# EAGLE design csa_scsi_v1.2b (EAGLE 4.16)
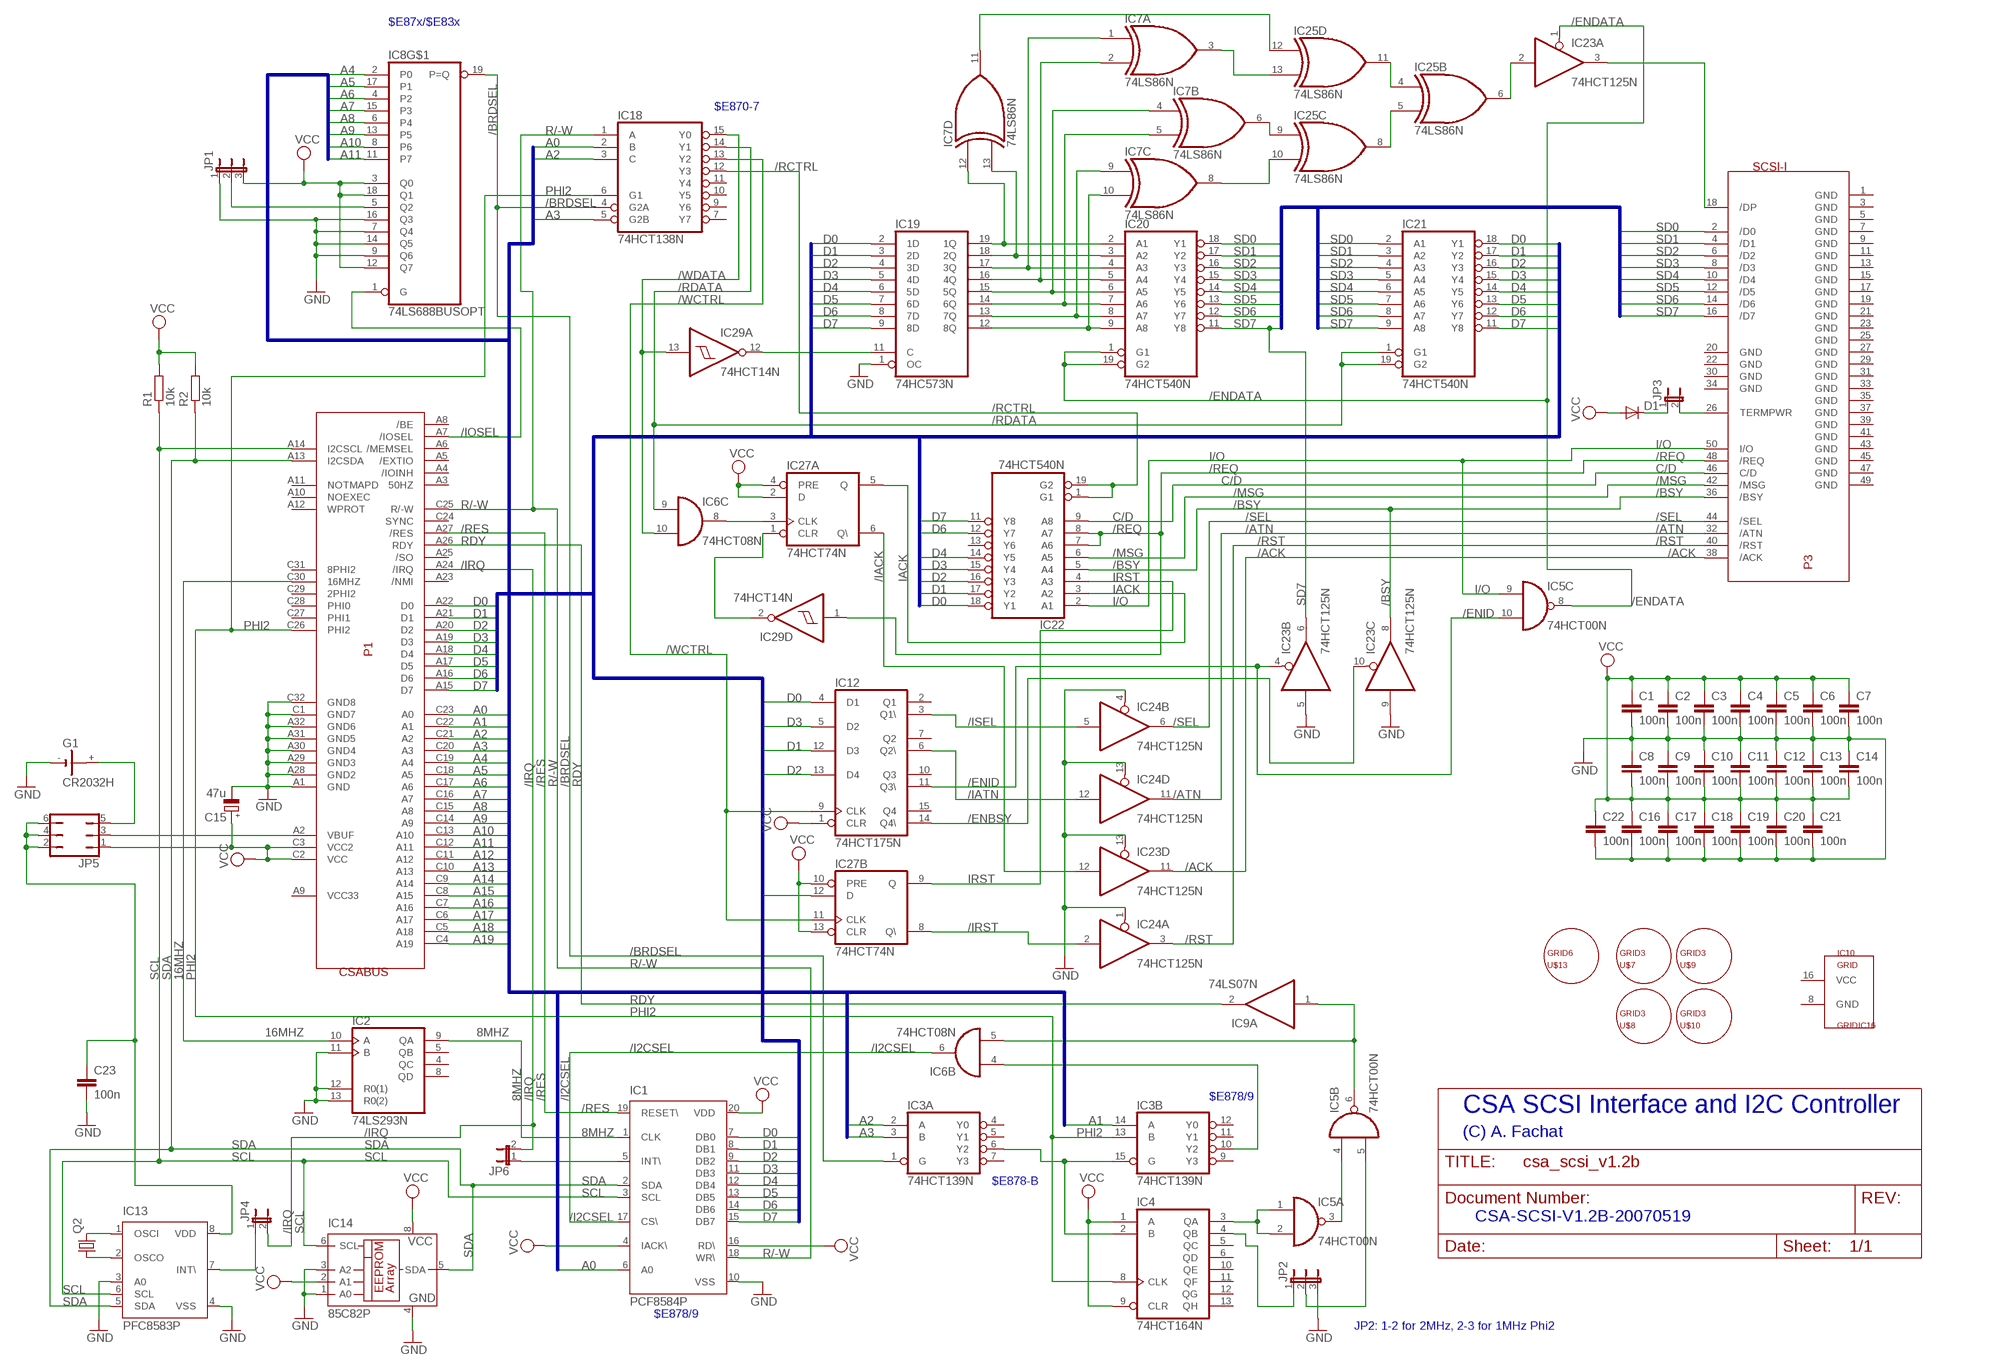
[diagram p0: schematic, sheet 1]

## Parts
C1  100n  C-EU025-025X050  [C025-025X050]
C2  100n  C-EU025-025X050  [C025-025X050]
C3  100n  C-EU025-025X050  [C025-025X050]
C4  100n  C-EU025-025X050  [C025-025X050]
C5  100n  C-EU025-025X050  [C025-025X050]
C6  100n  C-EU025-025X050  [C025-025X050]
C7  100n  C-EU025-025X050  [C025-025X050]
C8  100n  C-EU025-025X050  [C025-025X050]
C9  100n  C-EU025-025X050  [C025-025X050]
C10  100n  C-EU025-025X050  [C025-025X050]
C11  100n  C-EU025-025X050  [C025-025X050]
C12  100n  C-EU025-025X050  [C025-025X050]
C13  100n  C-EU025-025X050  [C025-025X050]
C14  100n  C-EU025-025X050  [C025-025X050]
C15  47u  CPOL-EUE2.5-5  [E2,5-5]
C16  100n  C-EU025-025X050  [C025-025X050]
C17  100n  C-EU025-025X050  [C025-025X050]
C18  100n  C-EU025-025X050  [C025-025X050]
C19  100n  C-EU025-025X050  [C025-025X050]
C20  100n  C-EU025-025X050  [C025-025X050]
C21  100n  C-EU025-025X050  [C025-025X050]
C22  100n  C-EU025-025X050  [C025-025X050]
C23  100n  C-EU025-025X050  [C025-025X050]
D1  DIODE-D-12.5  [D-12.5]
G1  CR2032H  [CR2032H]
IC1  PCF8584P  [DIL20]
IC2  74LS293N  [DIL14]
IC3  74HCT139N  [DIL16]
IC4  74HCT164N  [DIL14]
IC5  74HCT00N  [DIL14]
IC6  74HCT08N  [DIL14]
IC7  74LS86N  [DIL14]
IC8  74LS688BUSOPT  [DIL20]
IC9  74LS07N  [DIL14]
IC10  GRIDIC16  [GRIDIC8]
IC12  74HCT175N  [DIL16]
IC13  PFC8583P  [DIL08]
IC14  85C82P  [DIL8]
IC18  74HCT138N  [DIL16]
IC19  74HC573N  [DIL20]
IC20  74HCT540N  [DIL20]
IC21  74HCT540N  [DIL20]
IC22  74HCT540N  [DIL20]
IC23  74HCT125N  [DIL14]
IC24  74HCT125N  [DIL14]
IC25  74LS86N  [DIL14]
IC27  74HCT74N  [DIL14]
IC29  74HCT14N  [DIL14]
JP1  JP2E  [JP2]
JP2  JP2E  [JP2]
JP3  JP1E  [JP1]
JP4  JP1E  [JP1]
JP5  JP3Q  [JP3Q]
JP6  JP1E  [JP1]
P1  CSABUS  [CSABUS]
P3  SCSI-I  [FLAT50]
Q2  CRYTALHC49S  [HC49/S]
R1  10k  R-EU_0207/7  [0207/7]
R2  10k  R-EU_0207/7  [0207/7]
U$7  GRID3  [GRID3]
U$8  GRID3  [GRID3]
U$9  GRID3  [GRID3]
U$10  GRID3  [GRID3]
U$13  GRID6  [GRID6]

## Nets
8MHZ: IC1.1(CLK) IC2.9(QA)
16MHZ: IC2.10(A) P1.C30(16MHZ)
/ACK: IC23.11(D:O) P3.38(/ACK)
/ATN: IC24.11(D:O) P3.32(/ATN)
/BRDSEL: IC3.1(A:G) IC8.19(P=Q) IC18.4(G2A)
/BSY: IC22.5(A4) IC23.8(C:O) P3.36(/BSY)
/ENBSY: IC12.14(Q4\) IC23.10(C:OE)
/ENDATA: IC5.8(C:O) IC20.1(G1) IC20.19(G2) IC23.1(A:OE)
/ENID: IC5.10(C:I1) IC12.11(Q3\) IC23.4(B:OE)
/I2CSEL: IC1.17(CS\) IC6.6(B:O)
/IACK: IC23.12(D:I) IC27.6(A:Q\)
/IATN: IC12.6(Q2\) IC24.12(D:I)
/IOSEL: IC8.1(G) P1.A7(/IOSEL)
/IRQ: JP4.2 JP6.2 P1.A24(/IRQ)
/IRST: IC24.2(A:I) IC27.8(B:Q\)
/ISEL: IC12.3(Q1\) IC24.5(B:I)
/MSG: IC22.6(A5) P3.42(/MSG)
/RCTRL: IC18.12(Y3) IC22.1(G1) IC22.19(G2)
/RDATA: IC6.9(C:I0) IC18.14(Y1) IC21.1(G1) IC21.19(G2)
/REQ: IC22.7(A6) IC22.8(A7) IC29.1(D:I) P3.48(/REQ)
/RES: IC1.19(RESET\) P1.A27(/RES)
/RST: IC24.3(A:O) P3.40(/RST)
/SEL: IC24.6(B:O) P3.44(/SEL)
/WCTRL: IC12.9(CLK) IC18.13(Y2) IC27.11(B:CLK)
/WDATA: IC6.10(C:I1) IC18.15(Y0) IC29.13(A:I)
A0: IC1.6(A0) IC18.2(B) P1.C23(A0)
A1: IC3.14(B:A) P1.C22(A1)
A2: IC3.2(A:A) IC18.3(C) P1.C21(A2)
A3: IC3.3(A:B) IC18.5(G2B) P1.C20(A3)
A4: IC8.2(P0) P1.C19(A4)
A5: IC8.17(P1) P1.C18(A5)
A6: IC8.4(P2) P1.C17(A6)
A7: IC8.15(P3) P1.C16(A7)
A8: IC8.6(P4) P1.C15(A8)
A9: IC8.13(P5) P1.C14(A9)
A10: IC8.8(P6) P1.C13(A10)
A11: IC8.11(P7) P1.C12(A11)
A12: P1.C11(A12)
A13: P1.C10(A13)
A14: P1.C9(A14)
A15: P1.C8(A15)
A16: P1.C7(A16)
A17: P1.C6(A17)
A18: P1.C5(A18)
A19: P1.C4(A19)
C/D: IC22.9(A8) P3.46(C/D)
D0: IC1.7(DB0) IC12.4(D1) IC19.2(1D) IC21.18(Y1) IC22.18(Y1) P1.A22(D0)
D1: IC1.8(DB1) IC12.12(D3) IC19.3(2D) IC21.17(Y2) IC22.17(Y2) P1.A21(D1)
D2: IC1.9(DB2) IC12.13(D4) IC19.4(3D) IC21.16(Y3) IC22.16(Y3) P1.A20(D2)
D3: IC1.11(DB3) IC12.5(D2) IC19.5(4D) IC21.15(Y4) IC22.15(Y4) P1.A19(D3)
D4: IC1.12(DB4) IC19.6(5D) IC21.14(Y5) IC22.14(Y5) P1.A18(D4)
D5: IC1.13(DB5) IC19.7(6D) IC21.13(Y6) P1.A17(D5)
D6: IC1.14(DB6) IC19.8(7D) IC21.12(Y7) IC22.12(Y7) P1.A16(D6)
D7: IC1.15(DB7) IC19.9(8D) IC21.11(Y8) IC22.11(Y8) IC27.12(B:D) P1.A15(D7)
GND: C1.2 C2.2 C3.2 C4.2 C5.2 C6.2 C7.2 C8.1 C9.1 C10.1 C11.1 C12.1 C13.1 C14.1 C15.- C16.2 C17.2 C18.2 C19.2 C20.2 C21.2 C22.2 C23.2 G1.- IC1.10(VSS) IC2.11(B) IC2.12(R0(1)) IC2.13(R0(2)) IC8.7(Q4) IC8.9(Q6) IC8.14(Q5) IC8.16(Q3) IC13.3(A0) IC13.4(VSS) IC14.1(A0) IC14.3(A2) IC14.4(GND) IC19.1(OC) IC23.5(B:I) IC23.9(C:I) IC23.13(D:OE) IC24.1(A:OE) IC24.4(B:OE) IC24.13(D:OE) JP1.1 JP2.3 P1.A1(GND) P1.A28(GND2) P1.A29(GND3) P1.A30(GND4) P1.A31(GND5) P1.A32(GND6) P1.C1(GND7) P1.C32(GND8)
I/O: IC5.9(C:I0) IC22.2(A1) P3.50(I/O)
IACK: IC22.3(A2) IC27.5(A:Q)
IRST: IC22.4(A3) IC27.9(B:Q)
N$1: IC3.6(A:Y2) IC3.15(B:G) IC4.2(B)
N$2: D1.C JP3.1
N$3: IC8.5(Q2) JP1.2
N$4: IC3.10(B:Y2) IC6.4(B:I0)
N$5: IC4.3(QA) IC5.1(A:I0) IC5.2(A:I1)
N$6: JP3.2 P3.26(TERMPWR)
N$7: IC4.4(QB) JP2.1
N$8: IC5.5(B:I1) JP2.2
N$9: IC5.3(A:O) IC5.4(B:I0)
N$10: IC5.6(B:O) IC6.5(B:I1) IC9.1(A:I)
N$11: IC13.7(INT\) JP4.1
N$12: JP5.3 P1.A2(VBUF)
N$13: G1.+ JP5.5
N$14: IC7.12(D:I0) IC19.19(1Q) IC20.2(A1)
N$15: IC13.2(OSCO) Q2.1
N$16: IC13.1(OSCI) Q2.2
N$17: C23.1 IC13.8(VDD) JP5.2 JP5.4 JP5.6
N$18: IC7.13(D:I1) IC19.18(2Q) IC20.3(A2)
N$21: IC7.1(A:I0) IC19.17(3Q) IC20.4(A3)
N$22: IC7.2(A:I1) IC19.16(4Q) IC20.5(A4)
N$23: IC7.4(B:I0) IC19.15(5Q) IC20.6(A5)
N$24: IC7.5(B:I1) IC19.14(6Q) IC20.7(A6)
N$25: IC7.9(C:I0) IC19.13(7Q) IC20.8(A7)
N$26: IC7.10(C:I1) IC19.12(8Q) IC20.9(A8)
N$34: IC7.11(D:O) IC25.12(D:I0)
N$35: IC7.3(A:O) IC25.13(D:I1)
N$36: IC7.6(B:O) IC25.9(C:I0)
N$37: IC7.8(C:O) IC25.10(C:I1)
N$38: IC25.4(B:I0) IC25.11(D:O)
N$40: IC25.5(B:I1) IC25.8(C:O)
N$42: IC23.2(A:I) IC25.6(B:O)
N$43: IC23.3(A:O) P3.18(/DP)
N$53: IC6.8(C:O) IC27.3(A:CLK)
N$63: IC19.11(C) IC29.12(A:O)
N$68: IC27.1(A:CLR) IC29.2(D:O)
N$72: IC1.5(INT\) JP6.1
PHI2: IC3.13(B:B) IC4.8(CLK) IC18.6(G1) P1.C26(PHI2)
R/-W: IC1.18(WR\) IC18.1(A) P1.C25(R/-W)
RDY: IC9.2(A:O) P1.A26(RDY)
SCL: IC1.3(SCL) IC13.6(SCL) IC14.6(SCL) P1.A14(I2CSCL) R1.1
SD0: IC20.18(Y1) IC21.2(A1) P3.2(/D0)
SD1: IC20.17(Y2) IC21.3(A2) P3.4(/D1)
SD2: IC20.16(Y3) IC21.4(A3) P3.6(/D2)
SD3: IC20.15(Y4) IC21.5(A4) P3.8(/D3)
SD4: IC20.14(Y5) IC21.6(A5) P3.10(/D4)
SD5: IC20.13(Y6) IC21.7(A6) P3.12(/D5)
SD6: IC20.12(Y7) IC21.8(A7) P3.14(/D6)
SD7: IC20.11(Y8) IC21.9(A8) IC23.6(B:O) P3.16(/D7)
SDA: IC1.2(SDA) IC13.5(SDA) IC14.5(SDA) P1.A13(I2CSDA) R2.1
VCC: C1.1 C2.1 C3.1 C4.1 C5.1 C6.1 C7.1 C8.2 C9.2 C10.2 C11.2 C12.2 C13.2 C14.2 C15.+ C16.1 C17.1 C18.1 C19.1 C20.1 C21.1 C22.1 D1.A IC1.4(IACK\) IC1.16(RD\) IC1.20(VDD) IC4.1(A) IC4.9(CLR) IC8.3(Q0) IC8.12(Q7) IC8.18(Q1) IC12.1(CLR) IC14.2(A1) IC14.8(VCC) IC27.2(A:D) IC27.4(A:PRE) IC27.10(B:PRE) IC27.13(B:CLR) JP1.3 JP5.1 P1.C2(VCC) P1.C3(VCC2) R1.2 R2.2
Unconnected: G1.+@1(+) IC2.4(QC) IC2.5(QB) IC2.8(QD) IC3.4(A:Y0) IC3.5(A:Y1) IC3.7(A:Y3) IC3.9(B:Y3) IC3.11(B:Y1) IC3.12(B:Y0) IC4.5(QC) IC4.6(QD) IC4.10(QE) IC4.11(QF) IC4.12(QG) IC4.13(QH) IC5.11(D:O) IC5.12(D:I0) IC5.13(D:I1) IC6.1(A:I0) IC6.2(A:I1) IC6.3(A:O) IC6.11(D:O) IC6.12(D:I0) IC6.13(D:I1) IC9.3(B:I) IC9.4(B:O) IC9.5(C:I) IC9.6(C:O) IC9.8(D:O) IC9.9(D:I) IC9.10(E:O) IC9.11(E:I) IC9.12(F:O) IC9.13(F:I) IC12.2(Q1) IC12.7(Q2) IC12.10(Q3) IC12.15(Q4) IC14.7(NC) IC18.7(Y7) IC18.9(Y6) IC18.10(Y5) IC18.11(Y4) IC22.13(Y6) IC24.8(C:O) IC24.9(C:I) IC24.10(C:OE) IC25.1(A:I0) IC25.2(A:I1) IC25.3(A:O) IC29.3(E:I) IC29.4(E:O) IC29.5(F:I) IC29.6(F:O) IC29.8(C:O) IC29.9(C:I) IC29.10(B:O) IC29.11(B:I) P1.A3(50HZ) P1.A4(/IOINH) P1.A5(/EXTIO) P1.A6(/MEMSEL) P1.A8(/BE) P1.A9(VCC33) P1.A10(NOEXEC) P1.A11(NOTMAPD) P1.A12(WPROT) P1.A23(/NMI) P1.A25(/SO) P1.C24(SYNC) P1.C27(PHI1) P1.C28(PHI0) P1.C29(2PHI2) P1.C31(8PHI2)

## Buses
D[0..7]
A[0..19]
SD[0..7]

## Notes on the sheet
- $E87x/$E83x
- $E870-7
- $E878/9
- CSA SCSI Interface and I2C Controller
- (C) A. Fachat
- $E878-B
- CSA-SCSI-V1.2B-20070519
- $E878/9
- JP2: 1-2 for 2MHz, 2-3 for 1MHz Phi2

## Power pins joined to a net without a drawn wire
GND: IC2.7(GND) IC3.8(P:GND) IC4.7(GND) IC5.7(P:GND) IC6.7(P:GND) IC7.7(P:GND) IC8.10(GND) IC9.7(P:GND) IC10.8(GND) IC12.8(GND) IC18.8(GND) IC19.10(GND) IC20.10(GND) IC21.10(GND) IC22.10(GND) IC23.7(P:GND) IC24.7(P:GND) IC25.7(P:GND) IC27.7(P:GND) IC29.7(P:GND) P3.1(GND) P3.3(GND) P3.5(GND) P3.7(GND) P3.9(GND) P3.11(GND) P3.13(GND) P3.15(GND) P3.17(GND) P3.19(GND) P3.20(GND) P3.21(GND) P3.22(GND) P3.23(GND) P3.25(GND) P3.27(GND) P3.29(GND) P3.30(GND) P3.31(GND) P3.33(GND) P3.34(GND) P3.35(GND) P3.37(GND) P3.39(GND) P3.41(GND) P3.43(GND) P3.45(GND) P3.47(GND) P3.49(GND)
VCC: IC2.14(VCC) IC3.16(P:VCC) IC4.14(VCC) IC5.14(P:VCC) IC6.14(P:VCC) IC7.14(P:VCC) IC8.20(VCC) IC9.14(P:VCC) IC10.16(VCC) IC12.16(VCC) IC18.16(VCC) IC19.20(VCC) IC20.20(VCC) IC21.20(VCC) IC22.20(VCC) IC23.14(P:VCC) IC24.14(P:VCC) IC25.14(P:VCC) IC27.14(P:VCC) IC29.14(P:VCC)

## Library data of the parts
C1-C14 C16-C23 = rcl:C-EU: CAPACITOR, European symbol
C15 = rcl:CPOL-EU: POLARIZED CAPACITOR, European symbol
D1 = diode:DIODE-: DIODE
G1 = battery:CR2032H: LI BATTERY Varta
IC1 = micro-philips:PCF8584: I2C-Bus CONTROLLER
IC2 = 74xx-us:74*293: Decade and 4-bit BINARY COUNTER
IC3 = 74xx-eu:74*139: Dual 2-line to 4-line DECODER/DEMULTIPLEXER
IC4 = 74xx-eu:74*164: 8-bit parallel out SHIFT REGISTER
IC5 = 74xx-eu:74*00: Quad 2-input NAND gate
IC6 = 74xx-eu:74*08: Quad 2-input AND gate
IC7 IC25 = 74xx-us:74*86: Quad 2-input EXCLUSIV-OR (XOR) gate
IC8 = csa:74LS688BUSOPT
IC9 = 74xx-eu:74*07: Hex BUFFER, open collector high-voltage output
IC10 = csa:GRIDIC
IC12 = 74xx-eu:74*175: Qadruple D type FLIP FLOP, clear
IC13 = micro-philips:PFC8583: I2C-Bus CLOCK/CALENDAR
IC14 = microchip:85C*: Serial EEPROM 1 K/2 K/4 K, 5.0 V, CMOS 85C72/82/92
IC18 = 74xx-eu:74*138: 3-line to 8-line DECODER/DEMULTIPLEXER
IC19 = 74xx-eu:74*573: 8-bit D latch BUS DRIVER
IC20-IC22 = 74xx-eu:74*540: Octal BUFFER and LINE DRIVER, 3-state
IC23 IC24 = 74xx-eu:74*125: Quad bus BUFFER, 3-state
IC27 = 74xx-eu:74*74: Dual D type positive edge triggered FLIP FLOP, preset and clear
IC29 = 74xx-eu:74*14: Hex schmitt trigger INVERTER
JP1 JP2 = jumper:JP2E: JUMPER
JP3 JP4 JP6 = jumper:JP1E: JUMPER
JP5 = jumper:JP3Q: JUMPER
P1 = csa:CSABUS
P3 = csa:SCSI-I
Q2 = crystal:CRYTAL: CRYSTAL
R1 R2 = rcl:R-EU_: RESISTOR, European symbol
U$7-U$10 U$13 = csa:GRID

## Board
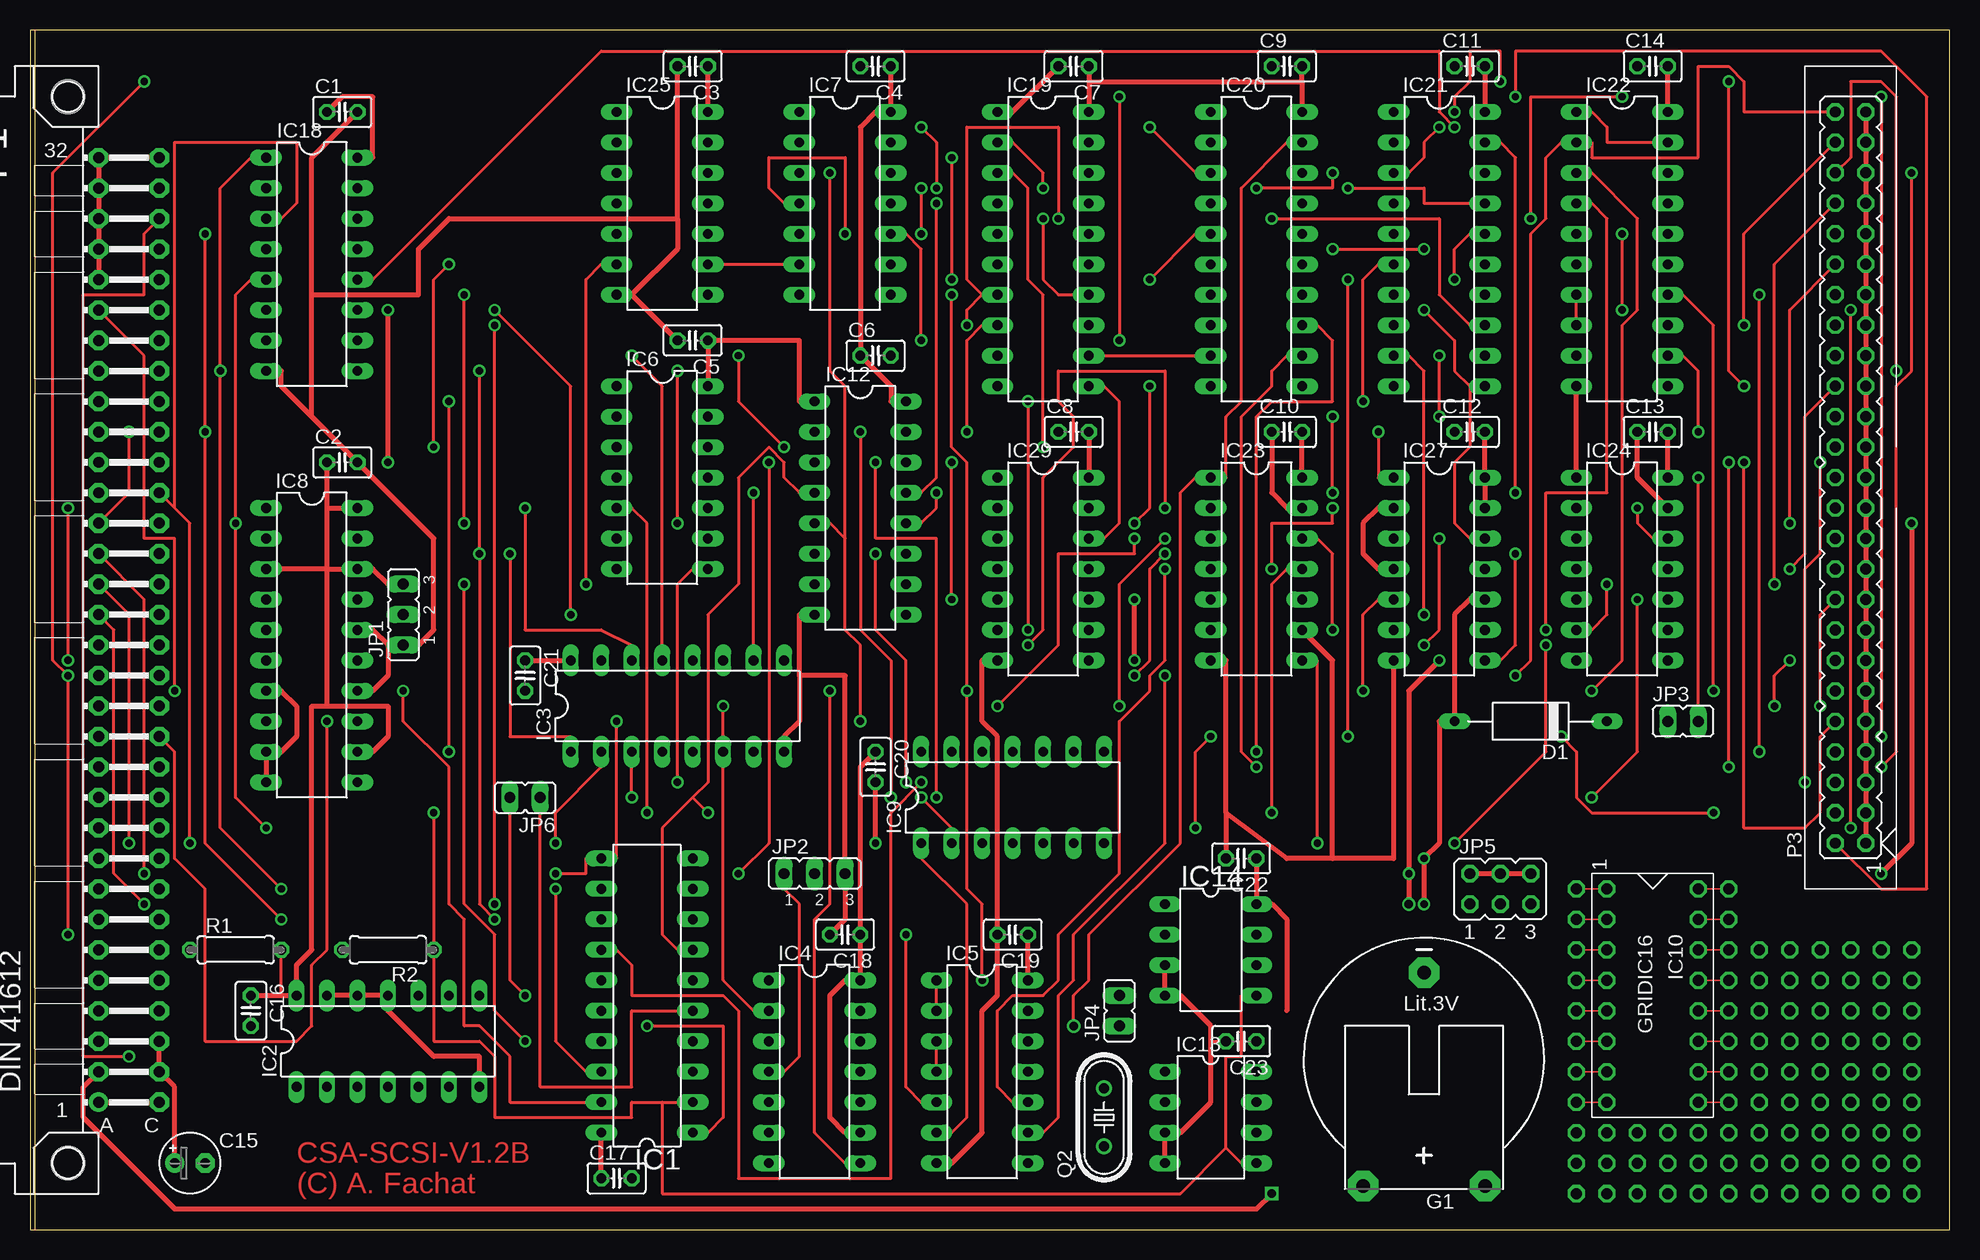
[diagram p1: board, top side]
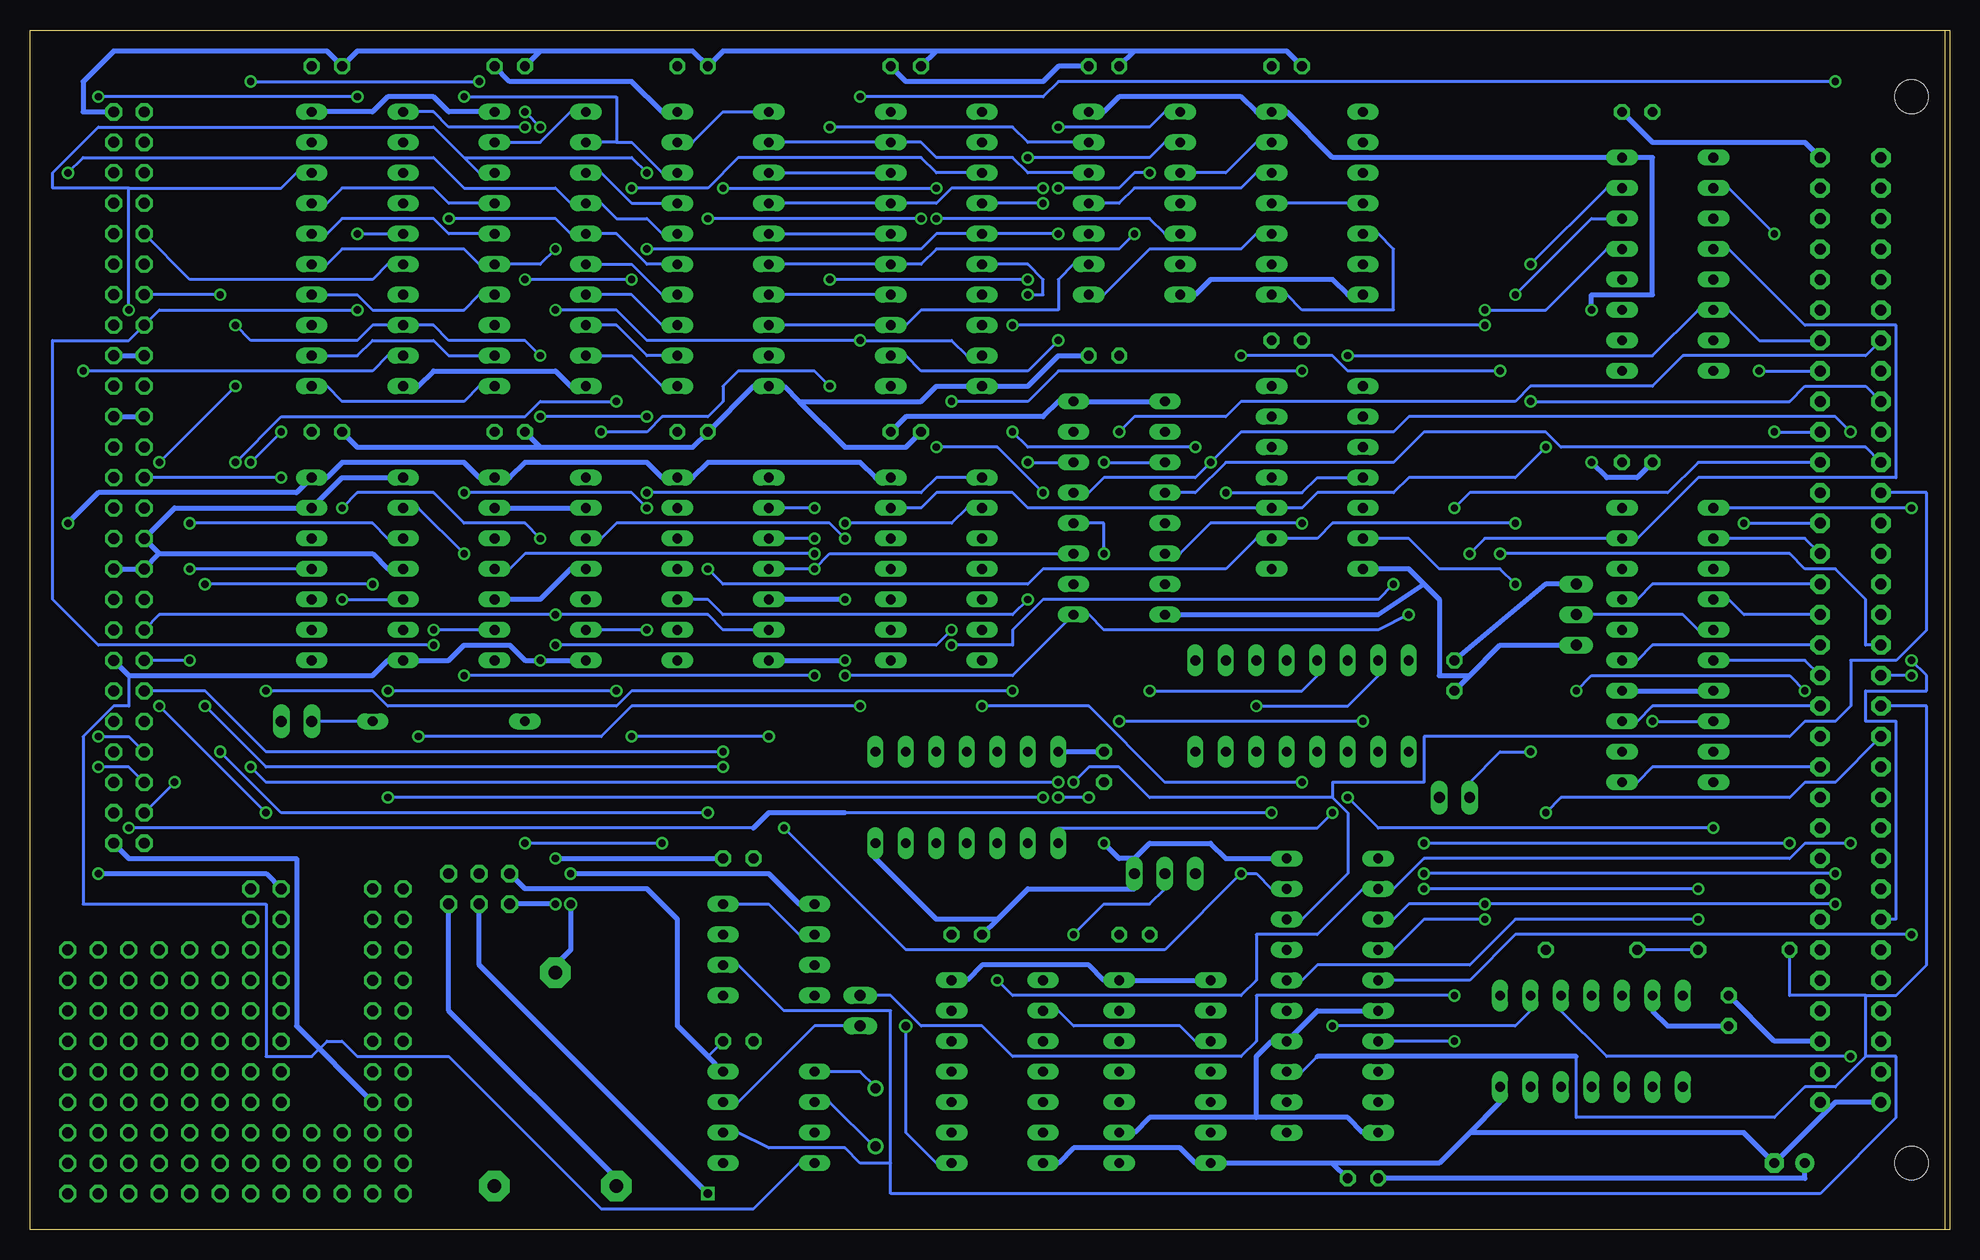
[diagram p2: board, bottom side, seen from below]

Size 160 x 100.03 mm. Coordinates in mm from the lower left corner, seen from the top.
Outline: 0,0.01 160,0.01 160,100.01 0,100.01 0,0.01
Copper layers (1*16): Top 0.035mm / dielectric 1.5mm / Bottom 0.035mm
Design rules "default": minimum track width 10mil, minimum drill 24mil, track to track 8mil, track to pad 8mil, pad to pad 8mil, via to via 8mil, smd to smd 8mil, copper to edge 40mil, drill to drill 8mil, minimum pad ring 10mil, minimum via ring 8mil, stop-mask expansion 4mil, vias tented up to drill 0mil, thermal gap 10mil

### Footprints (pad centres in the part's own frame; a part is rotated, then mirrored left to right if it is on the bottom)
C025-025X050 = drill 0.813 octagon: 1 -1.27,0; 2 1.27,0
E2,5-5 = drill 0.813 pad 1.6 round: + -1.27,0 | drill 0.813 pad 1.6 octagon: - 1.27,0
D-12.5 = drill 0.813 long: A 6.35,0; C -6.35,0
CR2032H = drill 1.118 pad 2.54 octagon: + 5.08,10.795; +@1 -5.08,10.795; - 0,-6.985
DIL20 = drill 0.813 long: 1 -11.43,-3.81; 2 -8.89,-3.81; 3 -6.35,-3.81; 4 -3.81,-3.81; 5 -1.27,-3.81; 6 1.27,-3.81; 7 3.81,-3.81; 8 6.35,-3.81; 9 8.89,-3.81; 10 11.43,-3.81; 11 11.43,3.81; 12 8.89,3.81; 13 6.35,3.81; 14 3.81,3.81; 15 1.27,3.81; 16 -1.27,3.81; 17 -3.81,3.81; 18 -6.35,3.81; 19 -8.89,3.81; 20 -11.43,3.81
DIL14 = drill 0.813 long: 1 -7.62,-3.81; 2 -5.08,-3.81; 3 -2.54,-3.81; 4 0,-3.81; 5 2.54,-3.81; 6 5.08,-3.81; 7 7.62,-3.81; 8 7.62,3.81; 9 5.08,3.81; 10 2.54,3.81; 11 0,3.81; 12 -2.54,3.81; 13 -5.08,3.81; 14 -7.62,3.81
DIL16 = drill 0.813 long: 1 -8.89,-3.81; 2 -6.35,-3.81; 3 -3.81,-3.81; 4 -1.27,-3.81; 5 1.27,-3.81; 6 3.81,-3.81; 7 6.35,-3.81; 8 8.89,-3.81; 9 8.89,3.81; 10 6.35,3.81; 11 3.81,3.81; 12 1.27,3.81; 13 -1.27,3.81; 14 -3.81,3.81; 15 -6.35,3.81; 16 -8.89,3.81
DIL20' = drill 0.813 long: 1 -10.16,-3.81; 2 -7.62,-3.81; 3 -5.08,-3.81; 4 -2.54,-3.81; 5 0,-3.81; 6 2.54,-3.81; 7 5.08,-3.81; 8 7.62,-3.81; 9 10.16,-3.81; 10 12.7,-3.81; 11 12.7,3.81; 12 10.16,3.81; 13 7.62,3.81; 14 5.08,3.81; 15 2.54,3.81; 16 0,3.81; 17 -2.54,3.81; 18 -5.08,3.81; 19 -7.62,3.81; 20 -10.16,3.81
GRIDIC8 = drill 0.914 octagon: 1 -8.89,-3.81; 2 -6.35,-3.81; 3 -3.81,-3.81; 4 -1.27,-3.81; 5 1.27,-3.81; 6 3.81,-3.81; 7 6.35,-3.81; 8 8.89,-3.81; 9 8.89,3.81; 10 6.35,3.81; 11 3.81,3.81; 12 1.27,3.81; 13 -1.27,3.81; 14 -3.81,3.81; 15 -6.35,3.81; 16 -8.89,3.81; X1 -8.89,-6.35; X2 -6.35,-6.35; X3 -3.81,-6.35; X4 -1.27,-6.35; X5 1.27,-6.35; X6 3.81,-6.35; X7 6.35,-6.35; X8 8.89,-6.35; X9 8.89,6.35; X10 6.35,6.35; X11 3.81,6.35; X12 1.27,6.35; X13 -1.27,6.35; X14 -3.81,6.35; X15 -6.35,6.35; X16 -8.89,6.35
DIL08 = drill 0.813 long: 1 -3.81,-3.81; 2 -1.27,-3.81; 3 1.27,-3.81; 4 3.81,-3.81; 5 3.81,3.81; 6 1.27,3.81; 7 -1.27,3.81; 8 -3.81,3.81
DIL8 = drill 0.813 long: 1 -3.81,-3.81; 2 -1.27,-3.81; 3 1.27,-3.81; 4 3.81,-3.81; 5 3.81,3.81; 6 1.27,3.81; 7 -1.27,3.81; 8 -3.81,3.81
JP2 = drill 0.914 long: 1 -2.54,0; 2 0,0; 3 2.54,0
JP1 = drill 0.914 long: 1 0,-1.27; 2 0,1.27
JP3Q = drill 0.914 octagon: 1 -2.54,-1.27; 2 -2.54,1.27; 3 0,-1.27; 4 0,1.27; 5 2.54,-1.27; 6 2.54,1.27
CSABUS = drill 0.914 pad 1.6 round: A1 7.62,36.83 | drill 0.914 pad 1.6 octagon: A2 7.62,34.29; A3 7.62,31.75; A4 7.62,29.21; A5 7.62,26.67; A6 7.62,24.13; A7 7.62,21.59; A8 7.62,19.05; A9 7.62,16.51; A10 7.62,13.97; A11 7.62,11.43; A12 7.62,8.89; A13 7.62,6.35; A14 7.62,3.81; A15 7.62,1.27; A16 7.62,-1.27; A17 7.62,-3.81; A18 7.62,-6.35; A19 7.62,-8.89; A20 7.62,-11.43; A21 7.62,-13.97; A22 7.62,-16.51; A23 7.62,-19.05; A24 7.62,-21.59; A25 7.62,-24.13; A26 7.62,-26.67; A27 7.62,-29.21; A28 7.62,-31.75; A29 7.62,-34.29; A30 7.62,-36.83; A31 7.62,-39.37; A32 7.62,-41.91; C1 2.54,36.83; C2 2.54,34.29; C3 2.54,31.75; C4 2.54,29.21; C5 2.54,26.67; C6 2.54,24.13; C7 2.54,21.59; C8 2.54,19.05; C9 2.54,16.51; C10 2.54,13.97; C11 2.54,11.43; C12 2.54,8.89; C13 2.54,6.35; C14 2.54,3.81; C15 2.54,1.27; C16 2.54,-1.27; C17 2.54,-3.81; C18 2.54,-6.35; C19 2.54,-8.89; C20 2.54,-11.43; C21 2.54,-13.97; C22 2.54,-16.51; C23 2.54,-19.05; C24 2.54,-21.59; C25 2.54,-24.13; C26 2.54,-26.67; C27 2.54,-29.21; C28 2.54,-31.75; C29 2.54,-34.29; C30 2.54,-36.83; C31 2.54,-39.37; C32 2.54,-41.91 | hole 2.794: 10.16,41.91; 10.16,-46.99
FLAT50 = drill 0.914 octagon: 1 -30.48,-1.27; 2 -30.48,1.27; 3 -27.94,-1.27; 4 -27.94,1.27; 5 -25.4,-1.27; 6 -25.4,1.27; 7 -22.86,-1.27; 8 -22.86,1.27; 9 -20.32,-1.27; 10 -20.32,1.27; 11 -17.78,-1.27; 12 -17.78,1.27; 13 -15.24,-1.27; 14 -15.24,1.27; 15 -12.7,-1.27; 16 -12.7,1.27; 17 -10.16,-1.27; 18 -10.16,1.27; 19 -7.62,-1.27; 20 -7.62,1.27; 21 -5.08,-1.27; 22 -5.08,1.27; 23 -2.54,-1.27; 24 -2.54,1.27; 25 0,-1.27; 26 0,1.27; 27 2.54,-1.27; 28 2.54,1.27; 29 5.08,-1.27; 30 5.08,1.27; 31 7.62,-1.27; 32 7.62,1.27; 33 10.16,-1.27; 34 10.16,1.27; 35 12.7,-1.27; 36 12.7,1.27; 37 15.24,-1.27; 38 15.24,1.27; 39 17.78,-1.27; 40 17.78,1.27; 41 20.32,-1.27; 42 20.32,1.27; 43 22.86,-1.27; 44 22.86,1.27; 45 25.4,-1.27; 46 25.4,1.27; 47 27.94,-1.27; 48 27.94,1.27; 49 30.48,-1.27; 50 30.48,1.27
HC49/S = drill 0.813 round: 1 -2.413,0; 2 2.413,0
0207/7 = drill 0.813 octagon: 1 -3.81,0; 2 3.81,0
GRID3 = drill 0.914 octagon: 1 -2.54,2.54; 2 0,2.54; 3 2.54,2.54; 13 -2.54,-2.54; 14 0,-2.54; 15 2.54,-2.54; A2 -2.54,0; B2 0,0; C2 2.54,0
GRID6 = drill 0.914 octagon: 1 -6.35,-1.27; 2 -3.81,-1.27; 3 -1.27,-1.27; 4 1.27,-1.27; 5 3.81,-1.27; 6 6.35,-1.27; 7 -6.35,3.81; 8 -3.81,3.81; 9 -1.27,3.81; 10 1.27,3.81; 11 3.81,3.81; 12 6.35,3.81; 13 -6.35,-6.35; 14 -3.81,-6.35; 15 -1.27,-6.35; 16 1.27,-6.35; 17 3.81,-6.35; 18 6.35,-6.35; A -6.35,1.27; A1 -6.35,6.35; A2 -6.35,-3.81; B -3.81,1.27; B1 -3.81,6.35; B2 -3.81,-3.81; C -1.27,1.27; C1 -1.27,6.35; C2 -1.27,-3.81; D 1.27,1.27; D1 1.27,6.35; D2 1.27,-3.81; E 3.81,1.27; E1 3.81,6.35; E2 3.81,-3.81; F 6.35,1.27; F1 6.35,6.35; F2 6.35,-3.81

### Placement (x,y rotation side)
C1  26.03,93.19 0 top
C2  26.03,63.98 0 top
C3  55.24,97 180 top
C4  70.48,97 180 top
C5  55.24,74.14 180 top
C6  70.48,72.87 0 top
C7  86.99,97 180 top
C8  86.99,66.52 0 top
C9  104.77,97 0 top
C10  104.77,66.52 0 top
C11  120.01,97 0 top
C12  120.01,66.52 0 top
C13  135.25,66.52 0 top
C14  135.25,97 0 top
C15  13.33,5.56 0 top
C16  18.41,18.26 270 top
C17  48.89,4.29 0 top
C18  67.94,24.61 180 top
C19  81.91,24.61 180 top
C20  70.48,38.58 270 top
C21  41.27,46.2 270 top
C22  100.96,30.96 180 top
C23  100.96,15.72 180 top
D1  125.09,42.39 180 top
G1  116.2,14.45 180 top
IC1  51.43,19.53 90 top
IC2  29.84,15.72 0 top
IC3  53.97,43.66 0 top
IC4  65.4,13.18 270 top
IC5  79.37,13.18 270 top
IC6  52.7,62.71 270 top
IC7  67.94,85.57 270 top
IC8  74LS688BUSOPT  [DIL20']  23.49,50.01 270 top
IC9  81.91,36.04 0 top
IC10  135.25,19.53 270 top
IC12  69.21,60.17 270 top
IC13  98.42,9.37 270 top
IC14  98.42,23.34 270 top
IC18  23.49,80.49 270 top
IC19  84.45,81.76 270 top
IC20  102.23,81.76 270 top
IC21  117.47,81.76 270 top
IC22  132.71,81.76 270 top
IC23  102.23,55.09 270 top
IC24  132.71,55.09 270 top
IC25  52.7,85.57 270 top
IC27  117.47,55.09 270 top
IC29  84.45,55.09 270 top
JP1  31.11,51.28 90 top
JP2  65.4,29.69 0 top
JP3  137.79,42.39 270 top
JP4  90.8,18.26 0 top
JP5  122.55,28.42 0 top
JP6  41.27,36.04 90 top
P1  13.33,47.47 180 top
P3  151.76,62.71 90 top
Q2  89.53,9.37 90 top
R1  17.14,23.34 0 top
R2  29.84,23.34 180 top
U$7  154.3,20.8 0 top
U$8  146.68,20.8 0 top
U$9  139.06,5.56 0 top
U$10  131.44,5.56 0 top
U$13  150.49,9.37 0 top

### Tracks (layer width: path | path; a pad name or v marks a point on that pad's centre or on a via)
8MHZ  (via drill 0.61)
  Top 0.254: v51.43,16.99 57.78,16.99 57.78,9.37 56.51,8.1 IC1.1
  Bottom 0.254: v51.43,16.99 36.19,16.99 34.92,18.26 IC2.9
16MHZ  (via drill 0.61)
  Top 0.254: v8.25,14.45 4.44,14.45 4.44,77.95 9.52,77.95 9.52,83.03 P1.C30
  Bottom 0.254: v8.25,14.45 28.57,14.45 32.38,18.26 IC2.10
/ACK  (via drill 0.61)
  Top 0.254: v103.5,34.77 103.5,53.82 104.77,55.09 IC23.11 | v144.14,39.85 v144.14,77.95
  Bottom 0.254: v103.5,34.77 139.06,34.77 v144.14,39.85 | v144.14,77.95 P3.38
/ATN  (via drill 0.61)
  Top 0.254: v146.68,55.09 147.95,56.36 147.95,67.79 P3.32
  Bottom 0.254: IC24.11 v146.68,55.09
/BRDSEL  (via drill 0.61)
  Top 0.254: v40,56.36 40,41.12 45.08,41.12 IC3.1
  Bottom 0.254: v40,56.36 38.73,57.63 IC8.19 26.03,57.63 20.95,62.71 4.44,62.71 4.44,75.41 12.06,75.41 18.41,81.76 IC18.4
/BSY  (via drill 0.61)
  Top 0.254: v107.31,32.23 107.31,47.47 IC23.8 | v118.74,32.23 126.36,39.85 v126.36,48.74 | v132.71,76.68 v132.71,83.03
  Bottom 0.254: v107.31,32.23 v118.74,32.23 | v126.36,48.74 154.3,48.74 158.11,52.55 158.11,74.14 151.76,74.14 P3.36 149.22,76.68 v132.71,76.68 | v132.71,83.03 IC22.5
/ENBSY  (via drill 0.61)
  Top 0.254: v76.83,52.55 v76.83,63.98
  Bottom 0.254: v76.83,52.55 78.1,51.28 102.23,51.28 103.5,52.55 IC23.10 | v76.83,63.98 IC12.14
/ENDATA  (via drill 0.7)
  Top 0.254: IC20.19 104.77,90.65 100.96,86.84 100.96,69.06 99.69,67.79 99.69,62.71 IC23.1 97.15,62.71 95.88,61.44 95.88,32.23 88.26,24.61 88.26,20.8 86.99,19.53 v86.99,16.99
  Bottom 0.254: IC20.19 104.77,90.65 102.23,93.19 IC20.1 | IC5.8 84.45,5.56 86.99,8.1 v86.99,16.99
/ENID  (via drill 0.61)
  Top 0.254: v94.61,55.09 94.61,47.47 93.34,46.2 93.34,44.93 90.8,42.39 90.8,29.69 85.72,24.61 85.72,20.8 84.45,19.53 81.91,19.53 80.64,18.26 80.64,11.91 81.91,10.64 IC5.10
  Bottom 0.254: IC23.4 v94.61,55.09 93.34,56.36 IC12.11
/I2CSEL  (via drill 0.61)
  Top 0.254: v41.27,15.72 38.73,18.26 38.73,24.61 36.19,27.15 v36.19,53.82
  Bottom 0.254: v36.19,53.82 37.46,55.09 42.54,55.09 45.08,57.63 IC6.6 | v41.27,15.72 IC1.17
/IACK  (via drill 0.61)
  Top 0.254: v108.58,50.01 108.58,56.36 107.31,57.63 IC23.12
  Bottom 0.254: v108.58,50.01 IC27.6
/IATN  (via drill 0.61)
  Top 0.254: v53.97,58.9 v53.97,71.6 | v83.18,69.06 v83.18,50.01 | v116.2,48.74 117.47,50.01 v117.47,57.63 | v133.98,60.17 133.98,58.9 135.25,57.63 IC24.12
  Bottom 0.254: v53.97,58.9 61.59,58.9 64.13,56.36 IC12.6 | v53.97,71.6 74.29,71.6 76.83,69.06 v83.18,69.06 | v83.18,50.01 84.45,48.74 v116.2,48.74 | v117.47,57.63 118.74,58.9 123.82,58.9 126.36,61.44 132.71,61.44 v133.98,60.17
/IOSEL  (via drill 0.61)
  Top 0.254: v3.17,47.47 v3.17,60.17
  Bottom 0.254: v3.17,47.47 1.9,46.2 1.9,44.93 6.98,44.93 6.98,42.39 4.44,42.39 4.44,25.88 P1.A7 | v3.17,60.17 IC8.1
/IRQ  (via drill 0.61)
  Top 0.254: v34.92,39.85 v34.92,69.06 | v41.27,19.53 40,20.8 JP6.2
  Bottom 0.254: v34.92,39.85 37.46,39.85 40,37.31 JP6.2 | v34.92,69.06 13.33,69.06 12.06,70.33 6.98,70.33 P1.A24 | v41.27,19.53 57.78,19.53 57.78,15.72 59.05,14.45 78.1,14.45 80.64,16.99 85.72,16.99 88.26,19.53 JP4.2
/IRST  (via drill 0.61)
  Top 0.254: v123.82,56.36 123.82,48.74 122.55,47.47 IC27.8
  Bottom 0.254: v123.82,56.36 127.63,60.17 IC24.2
/ISEL  (via drill 0.61)
  Top 0.254: v70.48,63.98 70.48,57.63 75.56,57.63 v75.56,36.04 | v130.17,36.04 133.98,39.85 v133.98,52.55
  Bottom 0.254: v75.56,36.04 v130.17,36.04 | v70.48,63.98 IC12.3 | v133.98,52.55 IC24.5
/MSG
  Bottom 0.254: P3.42 146.68,79.22 131.44,79.22 130.17,80.49 IC22.6
/RCTRL  (via drill 0.61)
  Top 0.254: v118.74,91.92 117.47,93.19 117.47,98.27 47.62,98.27 28.57,79.22 IC18.12 | IC22.19 131.44,90.65 131.44,91.92 130.17,93.19 IC22.1
  Bottom 0.254: v118.74,91.92 125.09,91.92 126.36,93.19 IC22.1
/RDATA  (via drill 0.61)
  Top 0.254: v36.19,58.9 v36.19,77.95 | v123.82,61.44 123.82,89.38 122.55,90.65 IC21.19 | v108.58,60.17 108.58,58.9 103.5,58.9 v103.5,55.09
  Bottom 0.254: IC21.19 117.47,90.65 114.93,93.19 IC21.1 | v36.19,58.9 51.43,58.9 52.7,57.63 IC6.9 57.78,57.63 60.32,55.09 75.56,55.09 76.83,53.82 102.23,53.82 v103.5,55.09 | v36.19,77.95 29.84,84.3 IC18.14 | v123.82,61.44 109.85,61.44 v108.58,60.17
/REQ  (via drill 0.61)
  Top 0.254: v108.58,61.44 v108.58,67.79 | v117.47,67.79 v117.47,72.87 | IC22.8 IC22.7 | P3.48 142.87,83.03 v142.87,75.41
  Bottom 0.254: v108.58,61.44 85.72,61.44 84.45,62.71 IC29.1 | v108.58,67.79 v117.47,67.79 | v117.47,72.87 118.74,74.14 125.09,74.14 126.36,75.41 IC22.8 131.44,75.41 132.71,74.14 141.6,74.14 v142.87,75.41
/RES  (via drill 0.61)
  Top 0.254: v31.11,44.93 31.11,42.39 34.92,38.58 34.92,27.15 36.19,25.88 36.19,16.99 37.46,16.99 40,14.45 40,10.64 IC1.19 | v12.06,44.93 12.06,57.63 9.52,57.63 9.52,72.87 P1.A27
  Bottom 0.254: v31.11,44.93 29.84,46.2 13.33,46.2 v12.06,44.93
/RST  (via drill 0.61)
  Top 0.254: v146.68,58.9 146.68,76.68 P3.40
  Bottom 0.254: v146.68,58.9 131.44,58.9 130.17,57.63 IC24.3
/SEL  (via drill 0.61)
  Top 0.254: v131.44,53.82 131.44,51.28 130.17,50.01 IC24.6 | v145.41,53.82 145.41,80.49 P3.44
  Bottom 0.254: v131.44,53.82 v145.41,53.82
/WCTRL  (via drill 0.61)
  Top 0.254: v38.73,76.68 45.08,70.33 v45.08,51.28 | v94.61,56.36 93.34,55.09 93.34,47.47 v92.07,46.2
  Bottom 0.254: v38.73,76.68 33.65,76.68 28.57,81.76 IC18.13 | v45.08,51.28 47.62,50.01 70.48,50.01 71.75,51.28 IC12.9 78.1,46.2 v92.07,46.2 | v94.61,56.36 118.74,56.36 120.01,55.09 IC27.11
/WDATA  (via drill 0.61)
  Top 0.254: v33.65,65.25 33.65,79.22 v34.92,80.49
  Bottom 0.254: IC29.13 85.72,60.17 84.45,61.44 78.1,61.44 76.83,60.17 IC6.10 53.97,60.17 52.7,61.44 46.35,61.44 45.08,62.71 36.19,62.71 v33.65,65.25 | v34.92,80.49 28.57,86.84 IC18.15
A0  (via drill 0.61)
  Top 0.254: v20.95,25.88 14.6,32.23 v14.6,66.52 v14.6,83.03
  Bottom 0.254: v20.95,25.88 36.19,25.88 40,22.07 52.7,22.07 53.97,20.8 IC1.6 | v14.6,66.52 P1.C23 | v14.6,83.03 18.41,86.84 IC18.2
A1  (via drill 0.61)
  Top 0.254: v41.27,60.17 41.27,50.01 47.62,50.01 50.16,48.74 IC3.14
  Bottom 0.254: v41.27,60.17 40,61.44 23.49,61.44 20.95,63.98 P1.C22
A2  (via drill 0.61)
  Top 0.254: v43.81,32.23 43.81,34.77 47.62,38.58 IC3.2 | v13.33,32.23 13.33,58.9 12.06,60.17 | 12.06,60.17 P1.C21 | 12.06,60.17 12.06,90.65 22.22,90.65 22.22,85.57 20.95,84.3 IC18.3
  Bottom 0.254: v13.33,32.23 v43.81,32.23
A3  (via drill 0.61)
  Top 0.254: v19.68,33.5 17.14,36.04 v17.14,58.9 17.14,77.95 18.41,79.22 IC18.5 | v50.16,36.04 IC3.3
  Bottom 0.254: v50.16,36.04 47.62,33.5 v19.68,33.5 | v17.14,58.9 P1.C20
A4
  Bottom 0.254: P1.C19 12.06,57.63 IC8.2
A5
  Bottom 0.254: P1.C18 24.76,53.82 26.03,52.55 IC8.17
A6
  Bottom 0.254: P1.C17 17.14,51.28 18.41,52.55 IC8.4
A7
  Bottom 0.254: P1.C16 24.76,48.74 26.03,47.47 IC8.15
A8
  Bottom 0.254: P1.C15 12.06,47.47 IC8.6
A9
  Bottom 0.254: P1.C14 24.76,43.66 26.03,42.39 IC8.13
A10  (via drill 0.61)
  Top 0.254: v24.76,42.39 24.76,23.34 23.49,22.07 23.49,16.99 22.22,15.72 14.6,15.72 14.6,28.42 12.06,30.96 12.06,39.85 P1.C13
  Bottom 0.254: v24.76,42.39 IC8.8
A11
  Bottom 0.254: P1.C12 24.76,38.58 26.03,37.31 IC8.11
C/D  (via drill 0.61)
  Top 0.254: v155.57,71.6 155.57,94.46 154.3,95.73 151.76,95.73 151.76,89.38 P3.46
  Bottom 0.254: v155.57,71.6 131.44,71.6 130.17,72.87 IC22.9
D0  (via drill 0.61)
  Top 0.254: v84.45,86.84 84.45,88.11 81.91,90.65 IC19.2 | v102.23,86.84 108.58,86.84 v108.58,88.11 | 55.24,36.04 56.51,37.31 56.51,51.28 59.05,53.82 59.05,62.71 61.59,65.25 62.86,63.98 62.86,62.71 64.13,61.44 IC12.4 | 55.24,36.04 52.7,33.5 52.7,24.61 53.97,23.34 IC1.7 | v151.76,33.5 v151.76,76.68 | 55.24,36.04 v56.51,34.77
  Bottom 0.254: 123.82,89.38 126.36,91.92 154.3,91.92 158.11,88.11 158.11,86.84 151.76,86.84 | 123.82,89.38 122.55,88.11 IC21.18 | 151.76,86.84 139.06,86.84 137.79,88.11 IC22.18 | v102.23,86.84 v84.45,86.84 | v108.58,88.11 109.85,89.38 123.82,89.38 | P1.A22 6.98,65.25 32.38,65.25 33.65,66.52 43.81,66.52 46.35,63.98 60.32,63.98 62.86,61.44 IC12.4 | v151.76,76.68 151.76,86.84 | 99.69,33.5 v151.76,33.5 | v56.51,34.77 92.07,34.77
  Bottom 0.406: 92.07,34.77 98.42,34.77 99.69,33.5
D1  (via drill 0.61)
  Top 0.254: v75.56,61.44 75.56,60.17 74.29,58.9 IC12.12 | v84.45,65.25 84.45,77.95 83.18,79.22 83.18,86.84 81.91,88.11 IC19.3 | v109.85,86.84 116.2,86.84 116.2,85.57 IC21.17 | v73.02,37.31 73.02,47.47 70.48,50.01 v70.48,56.36
  Bottom 0.254: 51.43,36.04 50.16,34.77 50.16,29.69 53.97,25.88 IC1.8 | 51.43,36.04 51.43,37.31 43.81,37.31 43.81,41.12 13.33,41.12 12.06,42.39 9.52,42.39 8.25,43.66 8.25,47.47 4.44,47.47 1.9,50.01 1.9,61.44 P1.A21 | IC21.17 125.09,85.57 126.36,86.84 133.98,86.84 135.25,85.57 IC22.17 | v75.56,61.44 79.37,65.25 v84.45,65.25 | v109.85,86.84 103.5,86.84 100.96,89.38 85.72,89.38 84.45,88.11 IC19.3 | 51.43,36.04 66.67,36.04 69.21,38.58 71.75,38.58 v73.02,37.31 | v70.48,56.36 70.48,58.9 IC12.12
D2  (via drill 0.61)
  Top 0.254: v59.05,29.69 61.59,32.23 v61.59,63.98 | v75.56,85.57 75.56,62.71 74.29,61.44 IC12.13 | P1.A20 8.25,61.44 v8.25,66.52 | v118.74,79.22 118.74,81.76 120.01,83.03 IC21.16 | v109.85,41.12 v109.85,79.22 | v98.42,41.12 97.15,39.85 v97.15,33.5
  Bottom 0.254: IC21.16 125.09,83.03 126.36,84.3 133.98,84.3 135.25,83.03 IC22.16 | IC1.9 56.51,28.42 57.78,29.69 v59.05,29.69 65.4,23.34 86.99,23.34 v97.15,33.5 | IC12.13 71.75,61.44 70.48,62.71 62.86,62.71 v61.59,63.98 59.05,66.52 46.35,66.52 45.08,67.79 9.52,67.79 v8.25,66.52 | v75.56,85.57 IC19.4 | v109.85,79.22 v118.74,79.22 | v98.42,41.12 v109.85,41.12
D3  (via drill 0.61)
  Top 0.254: v108.58,81.76 v116.2,81.76 | v48.89,42.39 48.89,30.96 IC1.11 46.35,30.96 46.35,29.69 v43.81,29.69 | v69.21,42.39 69.21,48.74 67.94,50.01 67.94,57.63 | 67.94,57.63 66.67,58.9 IC12.5 | P1.A19 9.52,52.55 v9.52,29.69 | v74.29,86.84 v74.29,83.03 | v66.67,88.11 66.67,71.6 67.94,70.33 67.94,57.63
  Bottom 0.254: IC22.15 135.25,80.49 133.98,81.76 123.82,81.76 122.55,80.49 IC21.15 117.47,80.49 v116.2,81.76 | v108.58,81.76 85.72,81.76 84.45,83.03 IC19.5 v74.29,83.03 | v48.89,42.39 v69.21,42.39 | v9.52,29.69 v43.81,29.69 | v74.29,86.84 69.21,86.84 67.94,88.11 v66.67,88.11
D4  (via drill 0.61)
  Top 0.254: v8.25,32.23 8.25,51.28 P1.A18 | v76.83,77.95 76.83,65.25 78.1,63.98 v78.1,44.93 78.1,28.42 79.37,27.15 v79.37,20.8 | v140.33,44.93 140.33,75.41 137.79,77.95 IC22.14
  Bottom 0.254: IC21.14 122.55,77.95 123.82,76.68 131.44,76.68 132.71,77.95 IC22.14 | v8.25,32.23 12.06,32.23 13.33,30.96 43.81,30.96 46.35,28.42 IC1.12 48.89,28.42 52.7,24.61 57.78,24.61 57.78,20.8 59.05,19.53 78.1,19.53 v79.37,20.8 | v76.83,77.95 75.56,77.95 75.56,79.22 76.83,80.49 IC19.6 | v140.33,44.93 131.44,44.93 130.17,43.66 111.12,43.66 109.85,44.93 v78.1,44.93
D5  (via drill 0.61)
  Top 0.254: 79.37,77.95 78.1,79.22 78.1,91.92 85.72,91.92 v85.72,84.3 | v103.5,84.3 117.47,84.3 117.47,77.95 120.01,75.41 IC21.13 | v9.52,27.15 6.98,29.69 6.98,50.01 P1.A17 | 79.37,77.95 78.1,76.68 v78.1,75.41 | v38.73,27.15 v38.73,75.41 | 79.37,77.95 IC19.7
  Bottom 0.254: v85.72,84.3 v103.5,84.3 | v9.52,27.15 v38.73,27.15 45.08,27.15 46.35,25.88 IC1.13 | v38.73,75.41 v78.1,75.41
D6  (via drill 0.61)
  Top 0.254: v38.73,25.88 37.46,27.15 v37.46,56.36 v37.46,71.6 | v78.1,66.52 78.1,74.14 79.37,75.41 IC19.8 | v62.86,65.25 59.05,69.06 v59.05,72.87 | v139.06,66.52 139.06,71.6 137.79,72.87 IC22.12 | v141.6,38.58 v141.6,63.98 | v74.29,37.31 71.75,34.77 71.75,4.29 59.05,4.29 59.05,18.26 57.78,19.53 50.16,19.53 50.16,22.07 48.89,23.34 IC1.14
  Bottom 0.254: IC21.12 125.09,72.87 126.36,74.14 131.44,74.14 132.71,72.87 IC22.12 | v38.73,25.88 43.81,25.88 46.35,23.34 IC1.14 | v37.46,56.36 13.33,56.36 12.06,55.09 9.52,55.09 6.98,52.55 6.98,48.74 P1.A16 | v78.1,66.52 76.83,65.25 v62.86,65.25 | v59.05,72.87 51.43,72.87 50.16,71.6 v37.46,71.6 | v141.6,63.98 v139.06,66.52 | v141.6,38.58 140.33,37.31 v74.29,37.31
D7  (via drill 0.61)
  Top 0.254: v3.17,24.61 v3.17,46.2 1.9,47.47 1.9,88.11 v9.52,95.73 | v116.2,76.68 118.74,74.14 118.74,71.6 120.01,70.33 | 120.01,70.33 120.01,65.25 118.74,63.98 118.74,58.9 120.01,57.63 IC27.12 | 120.01,70.33 IC21.11 | v90.8,94.46 v90.8,74.14
  Bottom 0.254: v3.17,24.61 36.19,24.61 40,20.8 IC1.15 | v3.17,46.2 P1.A15 | v116.2,76.68 111.12,76.68 108.58,74.14 v90.8,74.14 83.18,74.14 81.91,72.87 IC19.9 | IC22.11 135.25,70.33 133.98,69.06 123.82,69.06 122.55,70.33 IC21.11 | v9.52,95.73 74.29,95.73 75.56,94.46 v90.8,94.46
GND  (via drill 0.61, 0.7)
  Top 0.254: 104.77,60.17 IC23.13 | 98.42,15.72 C23.2
  Top 0.406: P1.A1 P1.C1 | IC2.13 IC2.12 IC2.11 29.84,18.26 33.65,14.45 37.46,14.45 IC2.7 | 64.13,46.2 64.13,51.28 IC12.8 | 64.13,46.2 64.13,42.39 62.86,41.12 IC3.8 | C18.2 67.94,25.88 JP2.3 67.94,46.2 64.13,46.2 | v70.48,32.23 C20.2 | IC29.7 79.37,47.47 79.37,42.39 80.64,41.12 C19.2 80.64,19.53 79.37,18.26 79.37,8.1 76.83,5.56 IC5.7 | P1.A28 P1.A29 P1.A30 P1.A31 P1.A32 P1.C32 | 23.49,67.79 20.95,70.33 20.95,71.6 IC18.8 | 23.49,67.79 C2.2 33.65,57.63 33.65,50.01 32.38,48.74 JP1.1 29.84,48.74 | IC8.10 IC8.9 20.95,39.85 22.22,41.12 22.22,43.66 20.95,44.93 IC8.7 | 29.84,48.74 28.57,50.01 IC8.16 | 29.84,48.74 29.84,46.2 28.57,44.93 IC8.14 | C1.2 23.49,89.38 23.49,77.95 | 23.49,67.79 23.49,77.95 | 50.16,77.95 C5.2 | C7.2 81.91,93.19 IC19.1 | 50.16,77.95 53.97,81.76 53.97,84.3 | 53.97,84.3 C3.2 | 50.16,77.95 IC25.7 | IC24.1 IC22.10 | C13.1 133.98,62.71 IC24.13 | 104.77,60.17 103.5,61.44 C10.1 | 99.69,34.77 99.69,47.47 IC23.7 | 99.69,34.77 104.77,30.96 108.58,30.96 | 108.58,30.96 113.66,30.96 IC27.7 | 108.58,30.96 108.58,47.47 IC23.9 | v92.07,47.47 v92.07,52.55 | P3.49 P3.47 P3.45 P3.43 P3.41 P3.39 P3.37 P3.35 P3.33 P3.31 P3.29 P3.27 P3.25 P3.23 P3.21 P3.19 P3.17 P3.15 P3.13 P3.11 P3.9 P3.7 P3.5 P3.3 P3.1 | 23.49,77.95 32.38,77.95 32.38,81.76 34.92,84.3 53.97,84.3 | 99.69,34.77 C22.2 | IC13.4 IC13.3 95.88,8.1 98.42,10.64 98.42,15.72 98.42,16.99 95.88,19.53 IC14.4 IC14.3 | v117.47,47.47 114.93,44.93 v114.93,29.69 v114.93,27.15
  Bottom 0.254: JP2.3 67.94,30.96 | IC25.7 50.16,77.95 | 95.88,27.15 IC14.1 | 151.76,46.2 151.76,43.66 153.03,43.66 155.57,41.12 155.57,27.15 140.33,27.15 140.33,14.45 136.52,14.45 135.25,15.72 133.98,15.72 132.71,14.45 125.09,14.45 112.39,1.75 99.69,1.75 95.88,5.56 IC13.4
  Bottom 0.406: P1.A1 9.52,10.64 C15.- 17.14,8.1 40,8.1 | C16.2 23.49,16.99 24.76,18.26 IC2.13 | 51.43,5.56 C17.2 | 51.43,5.56 IC4.7 62.86,5.56 64.13,6.83 73.02,6.83 74.29,5.56 IC5.7 | 40,8.1 42.54,5.56 51.43,5.56 | 40,8.1 37.46,10.64 IC2.7 | IC1.10 60.32,30.96 61.59,32.23 66.67,32.23 67.94,30.96 69.21,30.96 v70.48,32.23 | 79.37,25.88 76.83,28.42 67.94,28.42 JP2.3 | C19.2 79.37,25.88 | 79.37,25.88 84.45,25.88 89.53,30.96 IC9.7 | C1.2 24.76,90.65 12.06,90.65 P1.C32 | IC8.14 IC8.7 | 40,46.2 37.46,48.74 JP1.1 | 40,46.2 C21.2 | 43.81,53.82 42.54,52.55 42.54,46.2 40,46.2 | 43.81,53.82 45.08,55.09 IC6.7 | 43.81,53.82 47.62,51.28 IC12.8 | 117.47,98.27 104.77,98.27 C9.1 102.23,98.27 84.45,98.27 | 117.47,98.27 C11.1 | 117.47,98.27 132.71,98.27 C14.1 135.25,98.27 153.03,98.27 155.57,95.73 155.57,93.19 P3.49 | 50.16,77.95 51.43,79.22 61.59,79.22 62.86,77.95 IC7.7 | C3.2 55.24,98.27 67.94,98.27 | 67.94,98.27 C4.2 | 84.45,98.27 C7.2 | 67.94,98.27 84.45,98.27 | IC21.10 114.93,70.33 116.2,71.6 126.36,71.6 127.63,70.33 IC22.10 | IC24.1 133.98,62.71 IC24.13 147.95,60.17 P3.22 149.22,56.36 | 117.47,65.25 C12.1 | 117.47,65.25 104.77,65.25 C10.1 99.69,70.33 IC20.10 97.15,70.33 95.88,69.06 | C6.2 74.29,72.87 76.83,70.33 IC19.10 84.45,70.33 85.72,69.06 95.88,69.06 | C8.1 86.99,65.25 92.07,65.25 95.88,69.06 | C13.1 132.71,65.25 117.47,65.25 | IC27.7 v117.47,47.47 118.74,47.47 120.01,48.74 123.82,48.74 125.09,47.47 IC24.7 130.17,47.47 131.44,46.2 151.76,46.2 P3.13 | v92.07,52.55 IC23.5 | IC23.7 v92.07,47.47 | P3.33 P3.34 | 149.22,56.36 131.44,56.36 130.17,55.09 IC24.4 | 149.22,56.36 P3.20 P3.19 | P3.29 P3.30 | IC10.8 137.79,16.99 137.79,30.96 151.76,30.96 P3.1
  Bottom 0.406: v114.93,29.69 98.42,29.69 95.88,27.15 | v114.93,27.15 114.93,23.34 116.2,22.07 G1.-
I/O  (via drill 0.61)
  Top 0.254: v94.61,46.2 94.61,32.23 86.99,24.61 86.99,20.8 85.72,19.53 85.72,9.37 84.45,8.1 IC5.9 | v123.82,46.2 125.09,47.47 125.09,83.03 126.36,84.3 126.36,89.38 127.63,90.65 IC22.2 130.17,90.65 130.17,89.38 139.06,89.38 139.06,97 141.6,97 142.87,95.73 142.87,93.19 P3.50
  Bottom 0.254: v94.61,46.2 v123.82,46.2
IACK  (via drill 0.61)
  Top 0.254: v111.12,44.93 111.12,51.28 112.39,52.55 IC27.5 | v130.17,44.93 132.71,47.47 132.71,75.41 133.98,76.68 133.98,84.3 130.17,88.11 IC22.3
  Bottom 0.254: v111.12,44.93 v130.17,44.93
IRST  (via drill 0.61)
  Top 0.254: v126.36,50.01 126.36,61.44 131.44,61.44 131.44,84.3 130.17,85.57 IC22.4
  Bottom 0.254: IC27.9 v126.36,50.01
N$1  (via drill 0.61)
  Top 0.254: IC4.2 60.32,18.26 57.78,20.8 IC3.6 v57.78,43.66
  Bottom 0.254: v57.78,43.66 50.16,43.66 47.62,46.2 IC3.15
N$2
  Bottom 0.254: D1.C JP3.1
N$3
  Bottom 0.254: IC8.5 20.95,50.01 22.22,51.28 JP1.2
N$4  (via drill 0.61)
  Top 0.254: IC3.10 v60.32,61.44
  Bottom 0.254: v60.32,61.44 53.97,61.44 52.7,62.71 IC6.4
N$5
  Top 0.254: IC5.2 IC5.1
  Bottom 0.254: IC4.3 62.86,15.72 64.13,16.99 73.02,16.99 74.29,18.26 IC5.2
N$6  (via drill 0.61)
  Top 0.254: JP3.2 v139.06,62.71
  Bottom 0.254: v139.06,62.71 P3.26
N$7
  Top 0.254: IC4.4 62.86,13.18 64.13,14.45 64.13,27.15 62.86,28.42 JP2.1
N$8  (via drill 0.61)
  Top 0.254: v73.02,24.61 73.02,11.91 74.29,10.64 IC5.5
  Bottom 0.254: v73.02,24.61 70.48,27.15 66.67,27.15 65.4,28.42 JP2.2
N$9
  Top 0.254: IC5.4 IC5.3
N$10  (via drill 0.61)
  Top 0.254: IC5.6 76.83,8.1 78.1,9.37 78.1,27.15 74.29,30.96 IC9.1 | v51.43,34.77 51.43,58.9 50.16,60.17 IC6.5
  Bottom 0.254: v51.43,34.77 52.7,33.5 74.29,33.5 IC9.1
N$11
  Bottom 0.254: IC13.7 100.96,10.64 94.61,16.99 JP4.1
N$12  (via drill 0.7)
  Top 0.406: P1.A2 4.44,11.91 4.44,9.37 12.06,1.75 102.23,1.75 v103.5,3.02
  Bottom 0.406: v103.5,3.02 122.55,22.07 JP5.3
N$13
  Bottom 0.406: G1.+ 111.12,4.29 125.09,18.26 JP5.5
N$14
  Bottom 0.254: IC7.12 76.83,88.11 78.1,89.38 84.45,89.38 85.72,90.65 IC19.19 IC20.2
N$15
  Bottom 0.254: IC13.2 93.34,10.64 89.53,6.83 Q2.1
N$16
  Bottom 0.254: Q2.2 89.53,11.91 90.8,13.18 IC13.1
N$17
  Top 0.406: JP5.2 JP5.4 JP5.6
  Bottom 0.254: 103.5,14.45 C23.1
  Bottom 0.406: IC13.8 103.5,14.45 106.04,16.99 106.04,25.88 108.58,28.42 118.74,28.42 JP5.2
N$18  (via drill 0.61)
  Top 0.254: v93.34,91.92 97.15,88.11 IC20.3
  Bottom 0.254: IC20.3 IC19.18 | v93.34,91.92 78.1,91.92 76.83,90.65 IC7.13
N$21  (via drill 0.61)
  Top 0.254: v74.29,91.92 75.56,90.65 v75.56,86.84
  Bottom 0.254: IC20.4 IC19.17 84.45,85.57 83.18,86.84 v75.56,86.84 | v74.29,91.92 66.67,91.92 65.4,93.19 IC7.1
N$22  (via drill 0.61)
  Top 0.254: v76.83,89.38 v76.83,79.22 | v93.34,79.22 97.15,83.03 IC20.5
  Bottom 0.254: IC20.5 IC19.16 | v76.83,89.38 66.67,89.38 65.4,90.65 IC7.2 | v76.83,79.22 v93.34,79.22
N$23  (via drill 0.61)
  Top 0.254: v67.94,83.03 67.94,89.38 61.59,89.38 61.59,86.84 62.86,85.57 IC7.4
  Bottom 0.254: IC20.6 IC19.15 85.72,80.49 84.45,81.76 69.21,81.76 v67.94,83.03
N$24  (via drill 0.61)
  Top 0.254: v84.45,84.3 84.45,79.22 85.72,77.95 IC19.14
  Bottom 0.254: IC19.14 IC20.7 | v84.45,84.3 66.67,84.3 65.4,83.03 IC7.5
N$25
  Bottom 0.254: IC20.8 IC19.13 86.99,75.41 85.72,76.68 74.29,76.68 74.29,79.22 73.02,80.49 IC7.9
N$26  (via drill 0.61)
  Top 0.254: IC19.12 IC20.9 | v74.29,74.14 74.29,81.76 73.02,83.03 IC7.10
  Bottom 0.254: v74.29,74.14 76.83,71.6 85.72,71.6 86.99,72.87 IC19.12
N$34
  Bottom 0.254: IC25.12 57.78,88.11 59.05,86.84 67.94,86.84 69.21,85.57 IC7.11
N$35
  Bottom 0.254: IC25.13 57.78,90.65 60.32,88.11 IC7.3
N$36
  Top 0.254: IC25.9 IC7.6
N$37
  Bottom 0.254: IC25.10 57.78,83.03 59.05,81.76 66.67,81.76 70.48,77.95 IC7.8
N$38
  Bottom 0.254: IC25.4 IC25.11
N$40
  Bottom 0.254: IC25.5 47.62,83.03 46.35,81.76 46.35,76.68 53.97,76.68 55.24,77.95 IC25.8
N$42  (via drill 0.61)
  Top 0.254: v46.35,53.82 46.35,79.22 47.62,80.49 IC25.6 | v83.18,48.74 84.45,50.01 84.45,62.71 86.99,65.25 86.99,67.79 85.72,69.06 85.72,71.6 94.61,71.6 v94.61,60.17
  Bottom 0.254: v46.35,53.82 47.62,52.55 75.56,52.55 78.1,50.01 78.1,48.74 v83.18,48.74 | v94.61,60.17 IC23.2
N$43  (via drill 0.61)
  Top 0.254: v94.61,57.63 90.8,53.82 v90.8,43.66 | v127.63,41.12 128.9,39.85 128.9,36.04 130.17,34.77 v140.33,34.77 | v149.22,43.66 149.22,51.28 P3.18
  Bottom 0.254: v90.8,43.66 109.85,43.66 112.39,41.12 v127.63,41.12 | v140.33,34.77 v149.22,43.66 | v94.61,57.63 IC23.3
N$53  (via drill 0.61)
  Top 0.254: v53.97,37.31 53.97,53.82 55.24,55.09 IC6.8 | v80.64,43.66 85.72,48.74 85.72,56.36 92.07,56.36 v92.07,57.63
  Bottom 0.254: v53.97,37.31 65.4,37.31 71.75,43.66 v80.64,43.66 | v92.07,57.63 93.34,58.9 111.12,58.9 112.39,57.63 IC27.3
N$63
  Top 0.254: IC29.12 89.53,57.63 90.8,58.9 90.8,69.06 89.53,70.33 IC19.11
N$68  (via drill 0.61)
  Top 0.254: v92.07,58.9 93.34,60.17 v93.34,70.33 | v112.39,66.52 112.39,62.71 IC27.1
  Bottom 0.254: v92.07,58.9 83.18,58.9 81.91,60.17 IC29.2 | v93.34,70.33 94.61,71.6 100.96,71.6 102.23,70.33 102.23,69.06 103.5,67.79 107.31,67.79 108.58,66.52 v112.39,66.52
N$72
  Top 0.254: IC1.5 50.16,18.26 50.16,11.91 42.54,11.91 JP6.1
PHI2  (via drill 0.61)
  Top 0.254: v66.67,44.93 66.67,27.15 65.4,25.88 65.4,8.1 67.94,5.56 IC4.8 | v50.16,72.87 52.7,70.33 IC3.13
  Bottom 0.254: P1.C26 15.87,74.14 18.41,76.68 IC18.6 20.95,76.68 24.76,72.87 v50.16,72.87 | v66.67,44.93 53.97,44.93 52.7,46.2 IC3.13
R/-W  (via drill 0.61)
  Top 0.254: v43.81,28.42 43.81,15.72 46.35,13.18 IC1.18 | v20.95,28.42 15.87,33.5 v15.87,71.6 15.87,86.84 18.41,89.38 IC18.1
  Bottom 0.254: v20.95,28.42 v43.81,28.42 | v15.87,71.6 P1.C25
RDY  (via drill 0.61)
  Top 0.254: v74.29,36.04 76.83,33.5 IC9.2 | v71.75,36.04 71.75,47.47 69.21,50.01 v69.21,66.52
  Bottom 0.254: v71.75,36.04 v74.29,36.04 | v69.21,66.52 67.94,67.79 60.32,67.79 59.05,69.06 36.19,69.06 34.92,70.33 24.76,70.33 22.22,72.87 6.98,72.87 P1.A26
SCL
  Bottom 0.254: 52.7,14.45 53.97,13.18 IC1.3 | 31.11,14.45 31.11,9.37 14.6,9.37 12.06,11.91 9.52,11.91 6.98,14.45 | 6.98,14.45 6.98,19.53 | 6.98,19.53 4.44,19.53 1.9,22.07 1.9,43.66 P1.A14 | 88.26,5.56 90.8,5.56 92.07,6.83 98.42,6.83 100.96,8.1 IC13.6 | 88.26,5.56 88.26,18.26 97.15,18.26 100.96,22.07 IC14.6 | 88.26,5.56 88.26,3.02 10.79,3.02 4.44,9.37 4.44,14.45 6.98,14.45 | R1.1 13.33,19.53 6.98,19.53
  Bottom 0.406: 31.11,14.45 52.7,14.45
SD0  (via drill 0.61)
  Top 0.254: P3.2 154.3,28.42 158.11,28.42 158.11,94.46 154.3,98.27 123.82,98.27 v123.82,94.46
  Bottom 0.254: 111.12,90.65 109.85,90.65 107.31,88.11 IC20.18 | 111.12,90.65 IC21.2 | v123.82,94.46 111.12,94.46 111.12,90.65
SD1  (via drill 0.61)
  Top 0.254: v147.95,37.31 147.95,55.09 149.22,56.36 v149.22,63.98 | v142.87,70.33 141.6,71.6 v141.6,95.73 | v122.55,95.73 122.55,98.27 120.01,98.27 120.01,95.73 118.74,94.46 v118.74,93.19 | v117.47,91.92 116.2,90.65 116.2,89.38 114.93,88.11 IC21.3
  Bottom 0.254: IC20.17 109.85,85.57 112.39,88.11 IC21.3 | P3.4 v147.95,37.31 | v149.22,63.98 v142.87,70.33 | v141.6,95.73 v122.55,95.73 | v118.74,93.19 v117.47,91.92
SD2  (via drill 0.61)
  Top 0.254: v154.3,38.58 155.57,39.85 155.57,70.33 156.84,71.6 v156.84,88.11
  Bottom 0.254: IC20.16 107.31,83.03 108.58,84.3 111.12,84.3 112.39,85.57 IC21.4 114.93,85.57 116.2,86.84 123.82,86.84 126.36,89.38 155.57,89.38 v156.84,88.11 | P3.6 151.76,38.58 v154.3,38.58
SD3  (via drill 0.61)
  Top 0.254: v154.3,94.46 v154.3,41.12 | v132.71,94.46 125.09,94.46 v125.09,84.3
  Bottom 0.254: IC20.15 108.58,80.49 111.12,83.03 IC21.5 114.93,83.03 116.2,84.3 v125.09,84.3 | P3.8 151.76,41.12 v154.3,41.12 | v132.71,94.46 v154.3,94.46
SD4  (via drill 0.61)
  Top 0.254: P3.10 149.22,41.12 149.22,34.77 147.95,33.5 142.87,33.5 v142.87,63.98 | v111.12,69.06 111.12,79.22 112.39,80.49 IC21.6
  Bottom 0.254: IC20.14 107.31,77.95 109.85,80.49 IC21.6 | v142.87,63.98 139.06,67.79 118.74,67.79 117.47,69.06 v111.12,69.06
SD5  (via drill 0.61)
  Top 0.254: v102.23,39.85 102.23,67.79 103.5,69.06 108.58,69.06 108.58,74.14 107.31,75.41 IC20.13
  Bottom 0.254: IC20.13 107.31,75.41 109.85,77.95 IC21.7 | P3.12 145.41,44.93 140.33,39.85 v102.23,39.85
SD6  (via drill 0.61)
  Top 0.254: v146.68,47.47 145.41,46.2 v145.41,43.66 | v102.23,38.58 100.96,39.85 100.96,67.79 103.5,70.33 103.5,71.6 104.77,72.87 IC20.12
  Bottom 0.254: IC20.12 108.58,72.87 111.12,75.41 IC21.8 | v146.68,47.47 P3.14 | v145.41,43.66 140.33,38.58 v102.23,38.58
SD7  (via drill 0.61)
  Top 0.254: v116.2,51.28 116.2,71.6 114.93,72.87 IC21.9
  Bottom 0.254: IC20.11 107.31,70.33 109.85,72.87 IC21.9 | P3.16 149.22,51.28 v116.2,51.28 103.5,51.28 102.23,50.01 IC23.6
SDA  (via drill 0.61)
  Top 0.254: 52.7,10.64 50.16,10.64 50.16,9.37 38.73,9.37 38.73,14.45 37.46,15.72 33.65,15.72 R2.1 v33.65,34.77 | 52.7,10.64 IC1.2 | 99.69,6.83 100.96,5.56 IC13.5 | 99.69,6.83 99.69,14.45 100.96,14.45 100.96,19.53 IC14.5 | 99.69,6.83 95.88,3.02 52.7,3.02 52.7,10.64
  Bottom 0.254: v33.65,34.77 32.38,36.04 13.33,36.04 12.06,37.31 9.52,37.31 P1.A13
VCC  (via drill 0.61)
  Top 0.254: 28.57,39.85 IC8.12 | IC18.16 28.57,89.38 | IC7.14 70.48,93.19 | 20.95,19.53 R1.2
  Top 0.406: C21.1 IC3.16 | 28.57,39.85 29.84,41.12 29.84,43.66 24.76,43.66 | 24.76,60.17 C2.1 | 24.76,55.09 24.76,60.17 | 24.76,43.66 24.76,55.09 | 24.76,55.09 IC8.3 | 24.76,55.09 IC8.18 28.57,55.09 29.84,53.82 JP1.3 | 24.76,60.17 IC8.20 | C16.1 20.95,19.53 IC2.14 22.22,22.07 23.49,23.34 23.49,43.66 24.76,43.66 | IC5.14 C19.1 | C17.1 IC1.20 | IC4.9 67.94,8.1 66.67,9.37 66.67,19.53 67.94,20.8 IC4.14 C18.1 69.21,38.58 C20.1 | IC23.14 C10.2 | IC27.13 IC27.14 C12.2 | IC27.10 120.01,52.55 118.74,51.28 D1.A 117.47,42.39 117.47,32.23 v116.2,30.96 v116.2,27.15 | IC27.2 112.39,60.17 111.12,58.9 111.12,56.36 112.39,55.09 IC27.4 | IC24.14 C13.2 | v154.3,29.69 156.84,32.23 v156.84,58.9 | IC22.20 C14.2 | C11.2 IC21.20 | C7.1 88.26,95.73 | 88.26,95.73 IC19.20 | 106.04,95.73 C9.2 | 106.04,95.73 IC20.20 | 88.26,95.73 106.04,95.73 | IC25.14 C3.1 | C1.1 26.03,94.46 28.57,94.46 28.57,89.38 | IC7.14 C4.1 | IC6.14 C5.1 64.13,74.14 64.13,69.06 IC12.1 | C8.2 IC29.14 | IC12.16 71.75,69.06 71.75,70.33 C6.1 69.21,91.92 70.48,93.19 | v29.84,63.98 v29.84,76.68 | C22.1 IC14.8 103.5,27.15 104.77,25.88 104.77,18.26 | P1.C3 P1.C2 12.06,11.91 C15.+
  Bottom 0.254: R1.2 R2.2 | IC14.2 95.88,24.61 98.42,27.15 IC14.8
  Bottom 0.406: C21.1 33.65,53.82 JP1.3 | C16.1 14.6,15.72 P1.C3 | IC1.16 52.7,18.26 IC1.4 56.51,15.72 57.78,14.45 57.78,9.37 | C20.1 IC9.14 | IC4.1 IC4.14 70.48,20.8 71.75,22.07 80.64,22.07 81.91,20.8 IC5.14 | 57.78,9.37 66.67,9.37 67.94,8.1 IC4.9 | 57.78,9.37 50.16,9.37 48.89,8.1 IC1.20 | IC27.13 IC27.2 | IC27.4 114.93,55.09 117.47,52.55 IC27.10 | IC10.16 140.33,29.69 v154.3,29.69 | v156.84,58.9 154.3,61.44 137.79,61.44 IC24.14 135.25,62.71 133.98,63.98 123.82,63.98 122.55,62.71 IC27.14 120.01,62.71 118.74,63.98 108.58,63.98 107.31,62.71 IC23.14 104.77,62.71 103.5,63.98 90.8,63.98 89.53,62.71 IC29.14 | C11.2 120.01,95.73 109.85,95.73 107.31,93.19 IC20.20 | IC22.20 131.44,93.19 130.17,94.46 126.36,94.46 125.09,93.19 IC21.20 | IC12.1 IC12.16 74.29,69.06 75.56,67.79 86.99,67.79 C8.2 | IC7.14 70.48,93.19 69.21,94.46 59.05,94.46 57.78,93.19 IC25.14 55.24,93.19 51.43,89.38 IC18.16 24.76,89.38 24.76,77.95 29.84,77.95 v29.84,76.68 | C7.1 86.99,95.73 75.56,95.73 74.29,97 C4.1 | C2.1 26.03,62.71 28.57,62.71 v29.84,63.98 | v116.2,30.96 C22.1 | C15.+ 12.06,4.29 C17.1 | v116.2,27.15 JP5.1

### Text on the board
Top: CSA-SCSI-V1.2B | (C) A. Fachat